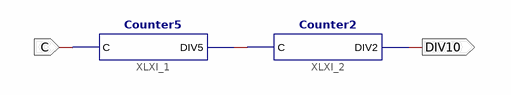
[diagram p0: schematic sheet 1]
// Xilinx ISE schematic Counter10.sch (spartan6) as structural Verilog: 2 symbols, 2 ports
module Counter10 (
  input  C,
  output DIV10
);

  wire XLXN_1;

  Counter5 XLXI_1 (.C(C), .DIV5(XLXN_1));
  Counter2 XLXI_2 (.C(XLXN_1), .DIV2(DIV10));
endmodule
